# EAGLE schematic 4x4_hirose (EAGLE 7.2.0)
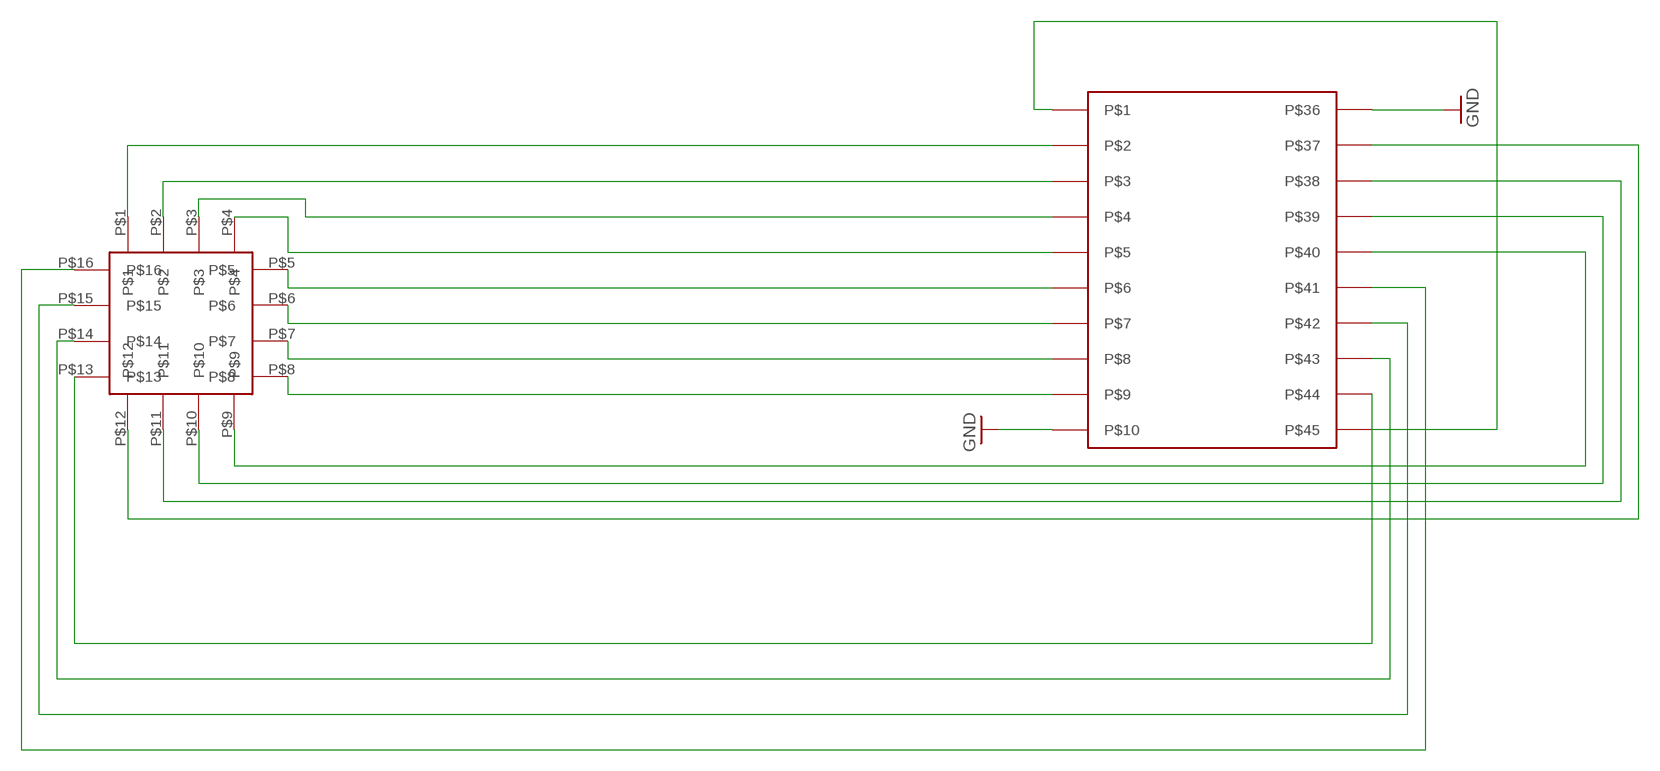
[diagram p0: schematic, sheet 1]

## Parts
U$1  GG_4X4_ARRAY  [GG_4X4_ARRAY]
U$3  HIROSE_DF40_70PIN  [HIROSE_DF40C-70DS]

## Nets
GND: U$3.P$10 U$3.P$36
N$1: U$1.P$4 U$3.P$5
N$20: U$1.P$1 U$3.P$2
N$30: U$1.P$2 U$3.P$3
N$40: U$1.P$3 U$3.P$4
N$60: U$1.P$5 U$3.P$6
N$70: U$1.P$6 U$3.P$7
N$80: U$1.P$7 U$3.P$8
N$90: U$1.P$8 U$3.P$9
N$100: U$1.P$9 U$3.P$40
N$110: U$1.P$10 U$3.P$39
N$120: U$1.P$11 U$3.P$38
N$130: U$1.P$12 U$3.P$37
N$140: U$1.P$13 U$3.P$44
N$150: U$1.P$14 U$3.P$43
N$160: U$1.P$15 U$3.P$42
N$170: U$1.P$16 U$3.P$41
REF: U$3.P$1 U$3.P$45

## Library data of the parts
U$1 = GG_4x4_3mildrill_20milspacing:GG_4X4_ARRAY
U$3 = GG_hirose20:HIROSE_DF40_70PIN